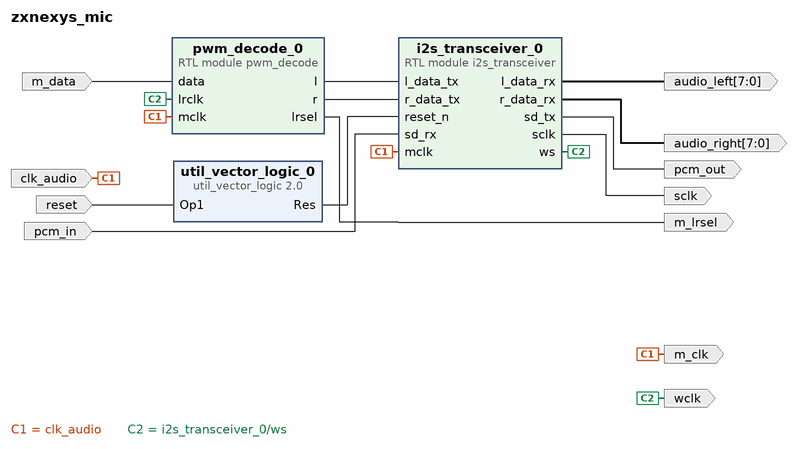
[diagram p0: block diagram of the top level]
# Vivado block design zxnexys_mic, xc7a100tcsg324-1, Vivado 2021.2
create_bd_design zxnexys_mic

create_bd_port -dir O sclk
create_bd_port -dir O wclk
create_bd_port -dir O pcm_out
create_bd_port -dir I pcm_in
create_bd_port -dir O m_clk
create_bd_port -dir O m_lrsel
create_bd_port -dir I m_data
create_bd_port -dir I clk_audio
create_bd_port -dir I reset
create_bd_port -dir O -from 7 -to 0 audio_left
create_bd_port -dir O -from 7 -to 0 audio_right

create_bd_cell -type module -reference i2s_transceiver i2s_transceiver_0
set_property -dict {CONFIG.d_width 8 CONFIG.mclk_sclk_ratio 8} [get_bd_cells i2s_transceiver_0]
create_bd_cell -type module -reference pwm_decode pwm_decode_0
create_bd_cell -type ip -vlnv xilinx.com:ip:util_vector_logic:2.0 util_vector_logic_0
set_property -dict {CONFIG.C_OPERATION not CONFIG.C_SIZE 1} [get_bd_cells util_vector_logic_0]

# ---- connections ----

connect_bd_net [get_bd_ports clk_audio] [get_bd_pins i2s_transceiver_0/mclk] [get_bd_ports m_clk] [get_bd_pins pwm_decode_0/mclk]
connect_bd_net [get_bd_pins i2s_transceiver_0/l_data_rx] [get_bd_ports audio_left]
connect_bd_net [get_bd_pins i2s_transceiver_0/r_data_rx] [get_bd_ports audio_right]
connect_bd_net [get_bd_pins i2s_transceiver_0/sclk] [get_bd_ports sclk]
connect_bd_net [get_bd_pins i2s_transceiver_0/sd_tx] [get_bd_ports pcm_out]
connect_bd_net [get_bd_pins i2s_transceiver_0/ws] [get_bd_ports wclk] [get_bd_pins pwm_decode_0/lrclk]
connect_bd_net [get_bd_ports m_data] [get_bd_pins pwm_decode_0/data]
connect_bd_net [get_bd_ports pcm_in] [get_bd_pins i2s_transceiver_0/sd_rx]
connect_bd_net [get_bd_pins pwm_decode_0/l] [get_bd_pins i2s_transceiver_0/l_data_tx]
connect_bd_net [get_bd_pins pwm_decode_0/lrsel] [get_bd_ports m_lrsel]
connect_bd_net [get_bd_pins pwm_decode_0/r] [get_bd_pins i2s_transceiver_0/r_data_tx]
connect_bd_net [get_bd_ports reset] [get_bd_pins util_vector_logic_0/Op1]
connect_bd_net [get_bd_pins util_vector_logic_0/Res] [get_bd_pins i2s_transceiver_0/reset_n]

validate_bd_design
save_bd_design
